# Altium project Electronic Load.PrjPcb
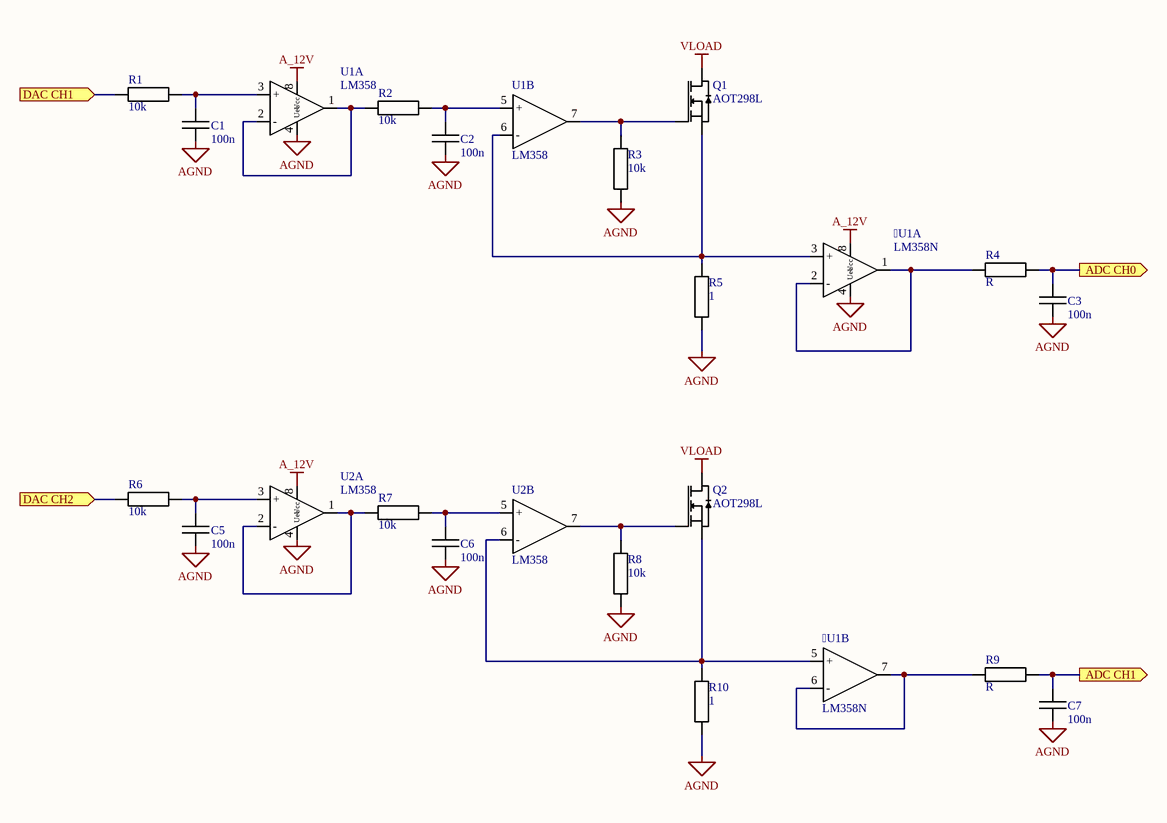
[diagram p0: Schematic.SchDoc]
2 sheets, 36 parts. Net scope: flat (ports and power ports of the same name join across sheets).
Sheets:
  Schematic.SchDoc
  Sheet1.SchDoc

## Sheet Schematic.SchDoc
size A4

### Parts
U1  LM358N  [SO 08]  (parts A,B of 2)
C1  Capacitance: 100n  [1206 package]  (hidden comment: Ceramic Capacitor)
C2  Capacitance: 100n  [1206 package]  (hidden comment: Ceramic Capacitor)
C3  Capacitance: 100n  [1206 package]  (hidden comment: Ceramic Capacitor)
C5  Capacitance: 100n  [1206 package]  (hidden comment: Ceramic Capacitor)
C6  Capacitance: 100n  [1206 package]  (hidden comment: Ceramic Capacitor)
C7  Capacitance: 100n  [1206 package]  (hidden comment: Ceramic Capacitor)
Q1  AOT298L
Q2  AOT298L
R1  Resistance: 10k  [1206 package]  (hidden comment: SMD Resistor)
R2  Resistance: 10k  [1206 package]  (hidden comment: SMD Resistor)
R3  Resistance: 10k  [1206 package]  (hidden comment: SMD Resistor)
R4  Resistance: R  [1206 package]  (hidden comment: SMD Resistor)
R5  Resistance: 1  [1206 package]  (hidden comment: SMD Resistor)
R6  Resistance: 10k  [1206 package]  (hidden comment: SMD Resistor)
R7  Resistance: 10k  [1206 package]  (hidden comment: SMD Resistor)
R8  Resistance: 10k  [1206 package]  (hidden comment: SMD Resistor)
R9  Resistance: R  [1206 package]  (hidden comment: SMD Resistor)
R10  Resistance: 1  [1206 package]  (hidden comment: SMD Resistor)
U1  LM358  (parts A,B of 2)
U2  LM358  (parts A,B of 2)

### Ports
ADC CH0 (out), ADC CH1 (out), DAC CH1 (in), DAC CH2 (in)

### Nets
A_12V: U1.8(Ucc) U1.8(Ucc) U2.8(Ucc)
AGND: U1.4(Uee) C1.1 C2.1 C3.1 C5.1 C6.1 C7.1 R3.1 R5.1 R8.1 R10.1 U1.4(Uee) U2.4(Uee)
VLOAD: Q1.2(D) Q2.2(D)
NetU1_1: U1.1 U1.2(-) R4.1
NetU1_3: U1.3(+) Q1.3(S) R5.2 U1.6(-)
NetU1_5: U1.5(+) Q2.3(S) R10.2 U2.6(-)
NetU1_6: U1.6(-) U1.7 R9.1
NetC1_2: C1.2 R1.2 U1.3(+)
NetC2_2: C2.2 R2.2 U1.5(+)
NetC3_2: C3.2 R4.2 ; port ADC CH0
NetC5_2: C5.2 R6.2 U2.3(+)
NetC6_2: C6.2 R7.2 U2.5(+)
NetC7_2: C7.2 R9.2 ; port ADC CH1
NetQ1_1: Q1.1(G) R3.2 U1.7
NetQ2_1: Q2.1(G) R8.2 U2.7
NetR1_1: R1.1 ; port DAC CH1
NetR2_1: R2.1 U1.1 U1.2(-)
NetR6_1: R6.1 ; port DAC CH2
NetR7_1: R7.1 U2.1 U2.2(-)

### Library data of the parts
U1 = LM358N: TL072CD-T Dual OPAMP
Q1 Q2 = AOT298L: NMOS / VGS = 100V / IDmax = 41A / Rdson = 14.5mOhm
R1-R10 = Resistor

## Sheet Sheet1.SchDoc
size A4
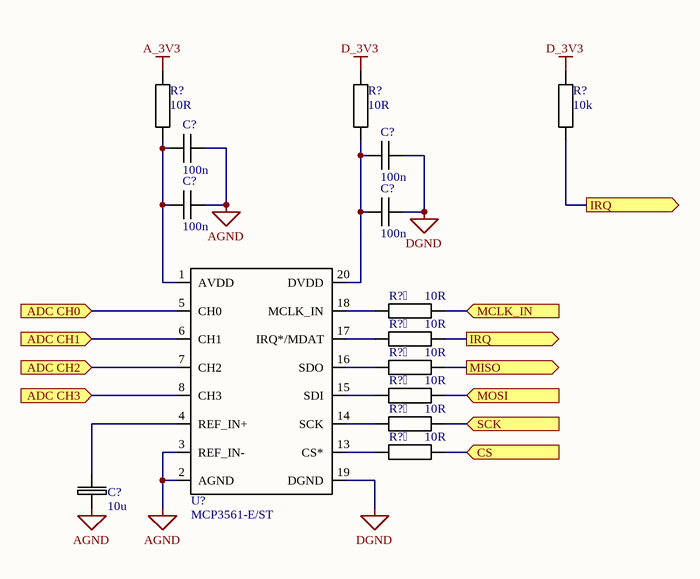
[diagram p1: Sheet1.SchDoc]

### Parts
(Parts that share a designator on the sheet are numbered #1, #2 ... from top to bottom, then left to right.)
C?#1  Capacitance: 100n  [1206 package]  (hidden comment: Ceramic Capacitor)
C?#2  Capacitance: 100n  [1206 package]  (hidden comment: Ceramic Capacitor)
C?#3  Capacitance: 100n  [1206 package]  (hidden comment: Ceramic Capacitor)
C?#4  Capacitance: 100n  [1206 package]  (hidden comment: Ceramic Capacitor)
C?#5  Capacitance: 10u  [B package]  (hidden comment: Electrolitic Capacitor)
R?#1  Resistance: 10R  [1206 package]  (hidden comment: SMD Resistor)
R?#2  Resistance: 10R  [1206 package]  (hidden comment: SMD Resistor)
R?#3  Resistance: 10R  [1206 package]  (hidden comment: SMD Resistor)
R?#4  Resistance: 10R  [1206 package]  (hidden comment: SMD Resistor)
R?#5  Resistance: 10R  [1206 package]  (hidden comment: SMD Resistor)
R?#6  Resistance: 10R  [1206 package]  (hidden comment: SMD Resistor)
R?#1  Resistance: 10R  [1206 package]  (hidden comment: SMD Resistor)
R?#2  Resistance: 10R  [1206 package]  (hidden comment: SMD Resistor)
R?#3  Resistance: 10k  [1206 package]  (hidden comment: SMD Resistor)
U?  MCP3561-E/ST

### Ports
ADC CH0 (in), ADC CH1 (in), ADC CH2 (in), ADC CH3 (in), CS (in), IRQ (out), MCLK_IN (in), MISO (out), MOSI (in), SCK (in)

### Nets
A_3V3: R?#1.2
AGND: C?#1.1 C?#3.1 C?#5.2 U?.2(AGND) U?.3(REF_IN-)
D_3V3: R?#2.2 R?#3.2
DGND: C?#2.1 C?#4.1 U?.19(DGND)
NetC3_2: U?.5(CH0) ; port ADC CH0
NetC7_2: U?.6(CH1) ; port ADC CH1
NetC?#1_2: C?#1.2 C?#3.2 R?#1.1 U?.1(AVDD)
NetC?#2_2: C?#2.2 C?#4.2 R?#2.1 U?.20(DVDD)
NetC?#5_1: C?#5.1 U?.4(REF_IN+)
NetR?#1_1: R?#1.1 U?.18(MCLK_IN)
NetR?#1_2: R?#1.2 ; port MCLK_IN
NetR?#2_1: R?#2.1 U?.17(IRQ*/MDAT)
NetR?#2_2: R?#2.2 R?#3.1 ; port IRQ
NetR?#3_1: R?#3.1 U?.16(SDO)
NetR?#3_2: R?#3.2 ; port MISO
NetR?#4_1: R?#4.1 U?.15(SDI)
NetR?#4_2: R?#4.2 ; port MOSI
NetR?#5_1: R?#5.1 U?.14(SCK)
NetR?#5_2: R?#5.2 ; port SCK
NetR?#6_1: R?#6.1 U?.13(CS*)
NetR?#6_2: R?#6.2 ; port CS
NetU?_7: U?.7(CH2) ; port ADC CH2
NetU?_8: U?.8(CH3) ; port ADC CH3

### Library data of the parts
C?#5 = Electrolitic Capacitor: SMD Capacitor
R?#1-R?#6 R?#1-R?#3 = Resistor

## Nets that join several sheets
AGND: Schematic (13 pins), Sheet1 (5 pins)
NetC3_2: Schematic (C3.2 R4.2), Sheet1 (U?.5)
NetC7_2: Schematic (C7.2 R9.2), Sheet1 (U?.6)